# EAGLE design airball_sensor_board_v3 (EAGLE 8.5.2)
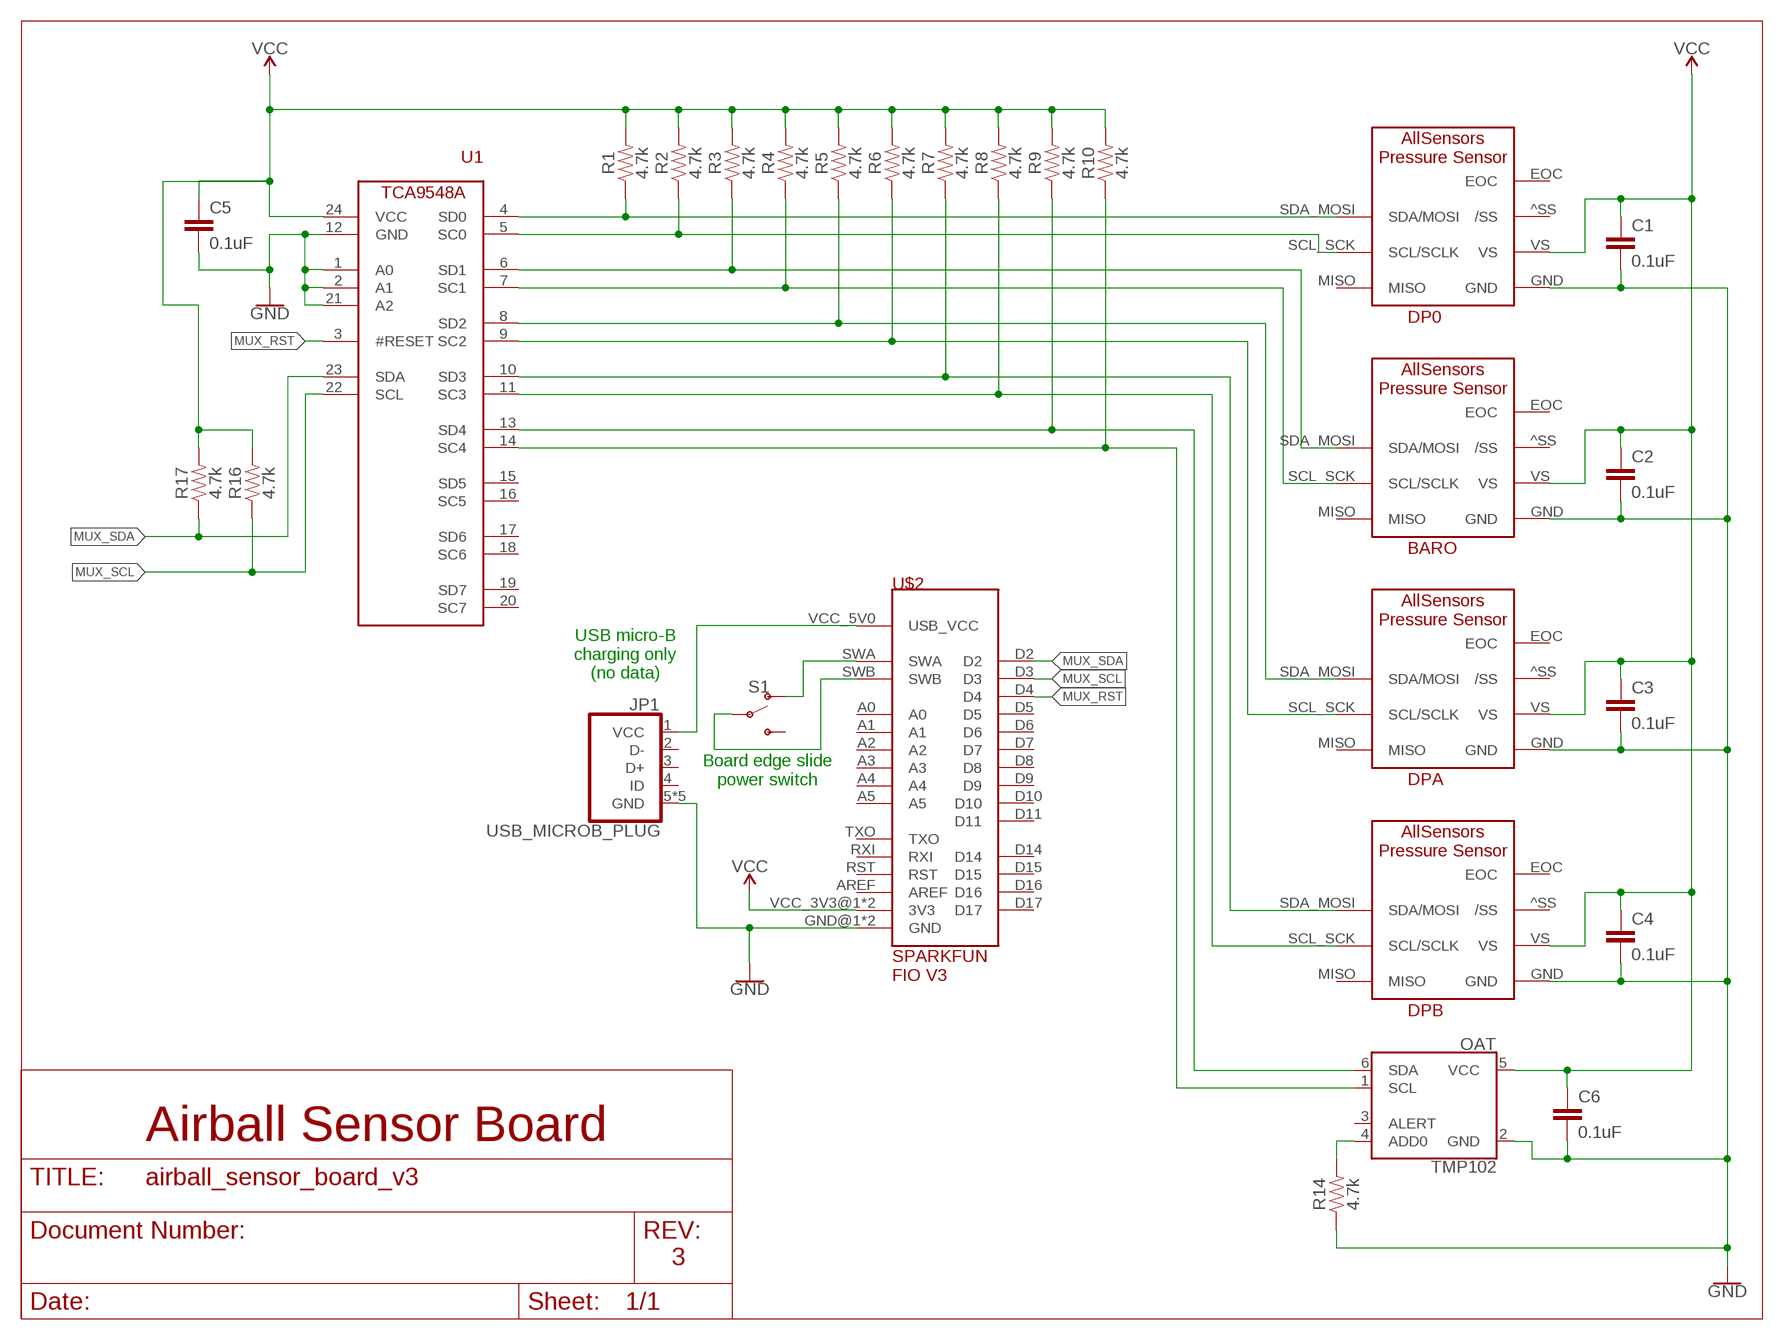
[diagram p0: schematic, sheet 1]

## Parts
BARO  ALL_SENSORS_DLHR_E1ND  [ALL_SENSORS_E1BD_8PIN_THRU]
C1  0.1uF  0.1UF-0603-25V-5%  [0603]
C2  0.1uF  0.1UF-0603-25V-5%  [0603]
C3  0.1uF  0.1UF-0603-25V-5%  [0603]
C4  0.1uF  0.1UF-0603-25V-5%  [0603]
C5  0.1uF  0.1UF-0603-25V-5%  [0603]
C6  0.1uF  0.1UF-0603-25V-5%  [0603]
DP0  ALL_SENSORS_DLHR_E1ND  [ALL_SENSORS_E1BD_8PIN_THRU]
DPA  ALL_SENSORS_DLHR_E1ND  [ALL_SENSORS_E1BD_8PIN_THRU]
DPB  ALL_SENSORS_DLHR_E1ND  [ALL_SENSORS_E1BD_8PIN_THRU]
JP1  USB_MICROB_PLUG  [USB_MICRO_B_TYCO]
OAT  TMP102  [SOT563]
R1  4.7k  4.7KOHM-0603-1/10W-1%  [0603]
R2  4.7k  4.7KOHM-0603-1/10W-1%  [0603]
R3  4.7k  4.7KOHM-0603-1/10W-1%  [0603]
R4  4.7k  4.7KOHM-0603-1/10W-1%  [0603]
R5  4.7k  4.7KOHM-0603-1/10W-1%  [0603]
R6  4.7k  4.7KOHM-0603-1/10W-1%  [0603]
R7  4.7k  4.7KOHM-0603-1/10W-1%  [0603]
R8  4.7k  4.7KOHM-0603-1/10W-1%  [0603]
R9  4.7k  4.7KOHM-0603-1/10W-1%  [0603]
R10  4.7k  4.7KOHM-0603-1/10W-1%  [0603]
R14  4.7k  4.7KOHM-0603-1/10W-1%  [0603]
R16  4.7k  4.7KOHM-0603-1/10W-1%  [0603]
R17  4.7k  4.7KOHM-0603-1/10W-1%  [0603]
S1  SWITCH-SPDT-SMD-RIGHT-ANGLE  [SWITCH_SPST_SMD_A]
U1  TCA9548ATSSOP24  [TSSOP24]
U$2  SPARKFUN_FIO_V3  [SPARKFUN_FIO_V3]

## Nets
GND [power]: BARO.GND C1.2 C2.2 C3.2 C4.2 C5.2 C6.2 DP0.GND DPA.GND DPB.GND JP1.5(GND) JP1.SH@1(GND) JP1.SH@2(GND) JP1.SH@3(GND) JP1.SH@4(GND) OAT.2(GND) R14.1 U1.1(A0) U1.2(A1) U1.12(GND) U1.21(A2) U$2.GND@1(GND) U$2.GND@2(GND)
MUX_RST: U1.3(#RESET) U$2.D4
MUX_SCL: R16.1 U1.22(SCL) U$2.D3
MUX_SDA: R17.1 U1.23(SDA) U$2.D2
OAT_ADD0: OAT.4(ADD0) R14.2
SCL_BARO: BARO.SCL_SCK(SCL/SCLK) R4.1 U1.7(SC1)
SCL_DP0: DP0.SCL_SCK(SCL/SCLK) R2.1 U1.5(SC0)
SCL_DPA: DPA.SCL_SCK(SCL/SCLK) R6.1 U1.9(SC2)
SCL_DPB: DPB.SCL_SCK(SCL/SCLK) R8.1 U1.11(SC3)
SCL_OAT: OAT.1(SCL) R10.1 U1.14(SC4)
SDA_BARO: BARO.SDA_MOSI(SDA/MOSI) R3.1 U1.6(SD1)
SDA_DP0: DP0.SDA_MOSI(SDA/MOSI) R1.1 U1.4(SD0)
SDA_DPA: DPA.SDA_MOSI(SDA/MOSI) R5.1 U1.8(SD2)
SDA_DPB: DPB.SDA_MOSI(SDA/MOSI) R7.1 U1.10(SD3)
SDA_OAT: OAT.6(SDA) R9.1 U1.13(SD4)
SWA [power]: S1.1(O) U$2.SWA
SWB [power]: S1.2(P) U$2.SWB
VCC_3V3 [power]: BARO.VS C1.1 C2.1 C3.1 C4.1 C5.1 C6.1 DP0.VS DPA.VS DPB.VS OAT.5(VCC) R1.2 R2.2 R3.2 R4.2 R5.2 R6.2 R7.2 R8.2 R9.2 R10.2 R16.2 R17.2 U1.24(VCC) U$2.VCC_3V3@1(3V3) U$2.VCC_3V3@2(3V3) ; supply symbol labelled VCC
VCC_USB [power]: JP1.1(VCC) U$2.VCC_5V0(USB_VCC)
Unconnected: BARO.^SS(/SS) BARO.EOC BARO.MISO DP0.^SS(/SS) DP0.EOC DP0.MISO DPA.^SS(/SS) DPA.EOC DPA.MISO DPB.^SS(/SS) DPB.EOC DPB.MISO JP1.2(D-) JP1.3(D+) JP1.4(ID) OAT.3(ALERT) S1.3(S) U1.15(SD5) U1.16(SC5) U1.17(SD6) U1.18(SC6) U1.19(SD7) U1.20(SC7) U$2.A0 U$2.A1 U$2.A2 U$2.A3 U$2.A4 U$2.A5 U$2.AREF U$2.D5 U$2.D6 U$2.D7 U$2.D8 U$2.D9 U$2.D10 U$2.D11 U$2.D14 U$2.D15 U$2.D16 U$2.D17 U$2.RST U$2.RXI U$2.TXO

## Notes on the sheet
- USB micro-B
  charging only
  (no data)
- Board edge slide
  power switch
- Airball Sensor Board
- 3

## Library data of the parts
BARO DP0 DPA DPB = microbuilder:ALL_SENSORS_DLHR_E1ND: All Sensors DLHR sensor, E1ND package 8 pin DIP 100 mil pin spacing 600 mil between pin rows 2 barbed pressure ports, same side
C1-C6 = SparkFun-Capacitors:0.1UF: 0.1µF ceramic capacitors A capacitor is a passive two-terminal electrical component used to store electrical energy temporarily in an electric field.; PROD_ID: CAP-08604
JP1 = jcole:USB_MICROB_PLUG: USB Micro-B Plug Comes in a variety of packages. Check out Hirose's ZX-x0 line: http://www.hirose.co.jp/cataloge_hp/e24200011.pdf
OAT = SparkFun-Sensors:TMP102: Texas Instruments TMP102 Low-Power Digital Temperature Sensor The TMP102 is a digital sensor (I2C a.k.a. TWI), has a resolution of 0.0625°C, and is accurate up to 0.5°C. This is a very handy sensor that requires a very low-current. Datasheet <http://www.sparkfun.com/datasheets/Sensors/Temperature/tmp102.pdf> SparkFun Products SparkFun Digital Temperature Sensor Breakout - TMP102 <https://www.sparkfun.com/products/11931> (SEN-11931); PROD_ID: IC-09303
R1-R10 R14 R16 R17 = SparkFun-Resistors:4.7KOHM: 4.7kΩ resistor A resistor is a passive two-terminal electrical component that implements electrical resistance as a circuit element. Resistors act to reduce current flow, and, at the same time, act to lower voltage levels within circuits. - Wikipedia; PROD_ID: RES-07857
S1 = SparkFun-Switches:SWITCH-SPDT: Single Pole, Double Throw (SPDT) Switch Single-pole, double-throw (SPDT) switch. Variant Overview SMD-AYZ0202 Surface Mount DPDT Switch <https://www.sparkfun.com/products/597> (COM-00597) Used on e.g. LilyPad Arduino USB - ATmega32U4 Board <https://www.sparkfun.com/products/12049> PTH-11.6X4.0MM SPDT Mini Power Switch <https://www.sparkfun.com/products/102> (COM-00102) Used on e.g. SparkFun Simon Says - Through-Hole Soldering Kit <https://www.sparkfun.com/products/10547> (KIT-10547) PTH-11.6X4.0MM-KIT KIT version of SPDT Mini Power Switch - Simplifies soldering by removing tStop of switch pins - only one side can be soldered. PTH-11.6X4.0MM-LOCK LOCK version of SPDT Mini Power Switch - Offset pins hold switch in place for easier soldering. SMD-RIGHT-ANGLE Surface Mount Right Angle Switch <https://www.sparkfun.com/products/10860> (COM-10860) Used on e.g. SparkFun ESP8266 Thing <https://www.sparkfun.com/products/13231>; PROD_ID: SWCH-10651; SF_SKU: COM-10860
U1 = microbuilder:TCA9548A: Texas Instruments TCA9548A 1-to-8 I2C multiplexer. Supported packages: TSSOP24
U$2 = microbuilder:SPARKFUN_FIO_V3

## Net classes
0 signal: width 0.152 mm
1 power: width 0.305 mm

## Board
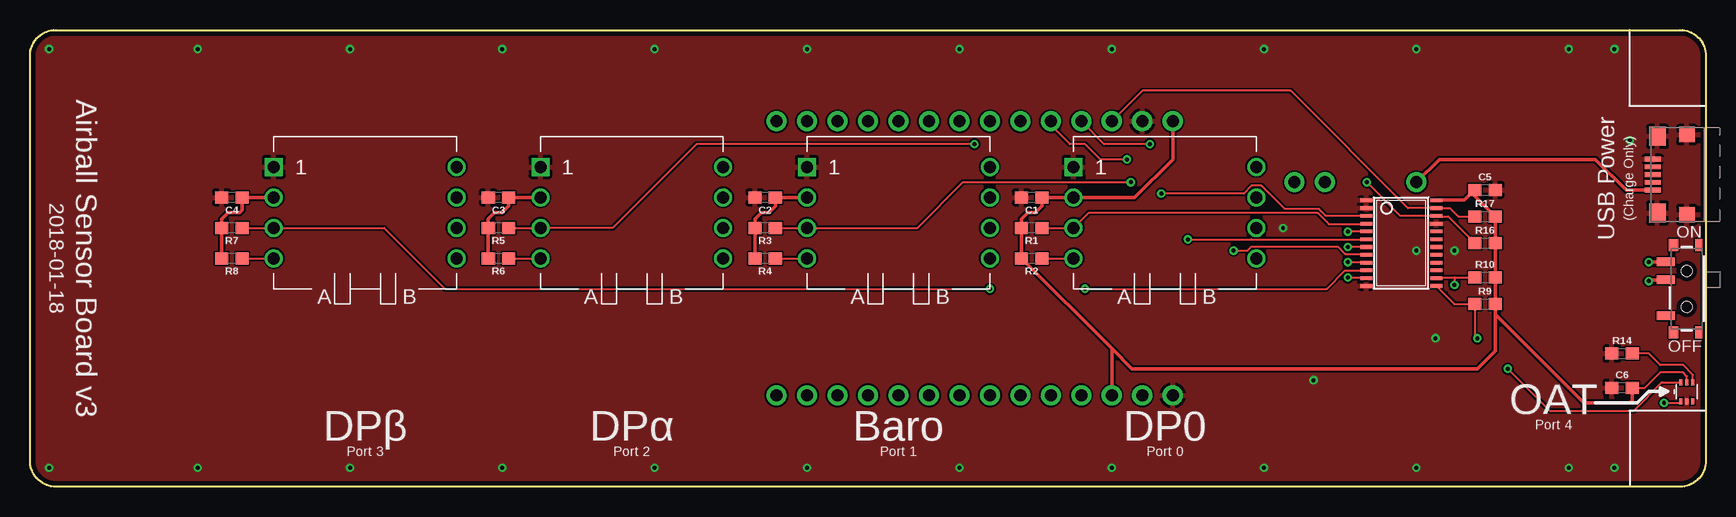
[diagram p1: board, top side]
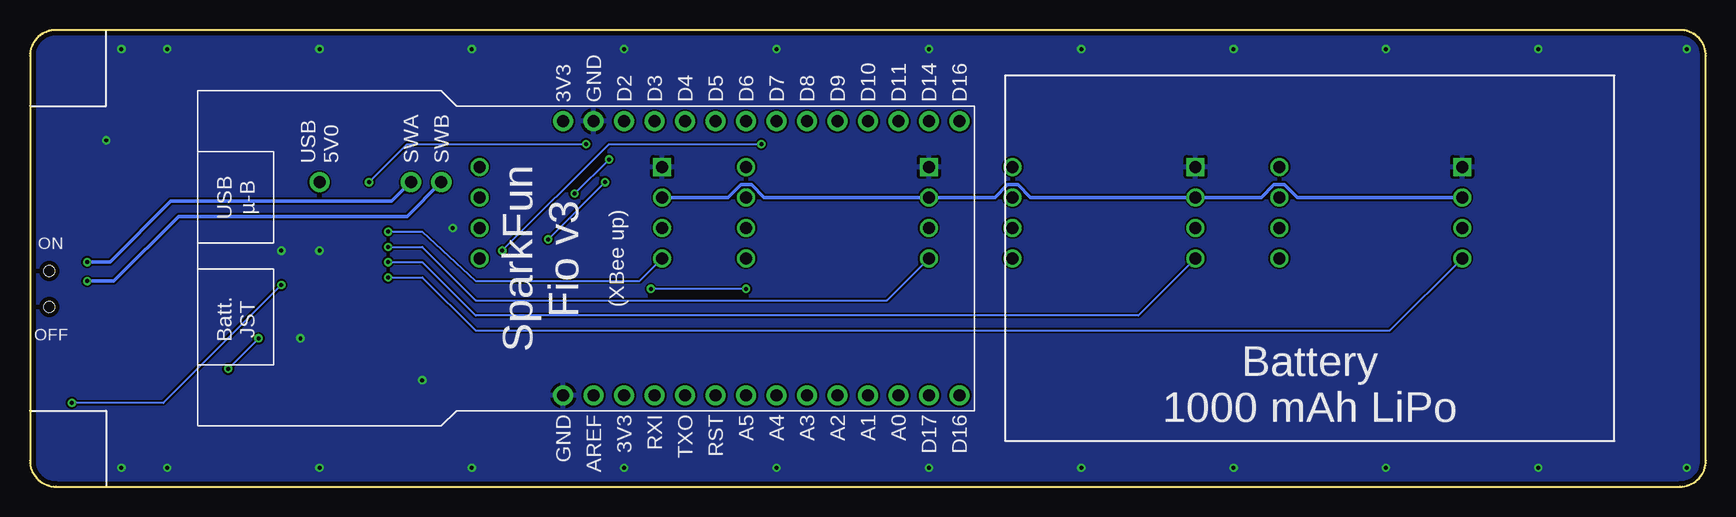
[diagram p2: board, bottom side, seen from below]

Size 139.7 x 38.1 mm. Coordinates in mm from the lower left corner, seen from the top.
Outline: 2.17,38.1 137.53,38.1 arc-90 139.7,35.93 139.7,2.17 arc-90 137.53,0 2.17,0 arc-90 0,2.17 0,35.93 arc-90 2.17,38.1
Copper layers (1*16): Top 0.0356mm / dielectric 1.5011mm / Bottom 0.0356mm
Design rules "oshpark-2layer *": minimum track width 6mil, minimum drill 13mil, track to track 6mil, track to pad 6mil, pad to pad 6mil, via to via 6mil, smd to smd 6mil, copper to edge 15mil, drill to drill 6mil, minimum pad ring 7mil, minimum via ring 7mil, stop-mask expansion 2.5mil, vias tented up to drill 15mil, thermal gap 10mil

### Footprints (pad centres in the part's own frame; a part is rotated, then mirrored left to right if it is on the bottom)
ALL_SENSORS_E1BD_8PIN_THRU = drill 1: ^SS 7.62,3.81; EOC 7.62,-3.81; MISO 7.62,-1.27; NC 7.62,1.27; SCL_SCK -7.62,-3.81; SDA_MOSI -7.62,-1.27; VS -7.62,1.27 | drill 1 square: GND -7.62,3.81
0603 = smd 1.1 x 1: 1 -0.85,0; 2 0.85,0
USB_MICRO_B_TYCO = smd 0.4 x 1.35: 1 -1.3,2.85; 2 -0.65,2.85; 3 0,2.85; 4 0.65,2.85; 5 1.3,2.85 | smd 1.3 x 1.3: SH@1 3.35,0; SH@2 -3.35,0 | smd 1.6 x 1.4: SH@3 3.2,2.45; SH@4 -3.2,2.45
SOT563 = smd 0.508 x 0.249: 1 -0.8,0.498; 2 -0.8,0.003; 3 -0.8,-0.506; 4 0.776,-0.506; 5 0.776,0.003; 6 0.776,0.498
SWITCH_SPST_SMD_A = smd 0.7 x 1.5: 1 -2.25,-1.75; 2 -0.75,-1.75; 3 2.25,-1.75 | smd 1 x 0.6: GND1 -3.65,1; GND3 3.65,1 | smd 1 x 0.8: GND2 -3.65,-1.1; GND4 3.65,-1.1 | hole 0.9: -1.5,0; 1.5,0
TSSOP24 = smd 0.305 x 0.991: 1 -3.575,-2.918; 2 -2.925,-2.918; 3 -2.275,-2.918; 4 -1.625,-2.918; 5 -0.975,-2.918; 6 -0.325,-2.918; 7 0.325,-2.918; 8 0.975,-2.918; 9 1.625,-2.918; 10 2.275,-2.918; 11 2.925,-2.918; 12 3.575,-2.918; 13 3.575,2.918; 14 2.925,2.918; 15 2.275,2.918; 16 1.625,2.918; 17 0.975,2.918; 18 0.325,2.918; 19 -0.325,2.918; 20 -0.975,2.918; 21 -1.625,2.918; 22 -2.275,2.918; 23 -2.925,2.918; 24 -3.575,2.918
SPARKFUN_FIO_V3 = drill 1 pad 1.676: A0 -11.43,-11.43; A1 -11.43,-8.89; A2 -11.43,-6.35; A3 -11.43,-3.81; A4 -11.43,-1.27; A5 -11.43,1.27; AREF -11.43,13.97; D2 11.43,11.43; D3 11.43,8.89; D4 11.43,6.35; D5 11.43,3.81; D6 11.43,1.27; D7 11.43,-1.27; D8 11.43,-3.81; D9 11.43,-6.35; D10 11.43,-8.89; D11 11.43,-11.43; D14 11.43,-13.97; D15 11.43,-16.51; D16 -11.43,-16.51; D17 -11.43,-13.97; GND@1 11.43,13.97; GND@2 -11.43,16.51; RST -11.43,3.81; RXI -11.43,8.89; SWA 6.35,29.21; SWB 6.35,26.67; TXO -11.43,6.35; VCC_3V3@1 11.43,16.51; VCC_3V3@2 -11.43,11.43; VCC_5V0 6.35,36.83

### Placement (x,y rotation side)
BARO  72.39,22.86 0 top
C1  83.5,24.13 180 top
C2  61.28,24.13 180 top
C3  39.05,24.13 180 top
C4  16.83,24.13 180 top
C5  121.28,24.77 0 top
C6  132.72,8.26 180 top
DP0  94.61,22.86 0 top
DPA  50.16,22.86 0 top
DPB  27.94,22.86 0 top
JP1  138.11,26.04 90 top
OAT  138.11,7.94 90 top
R1  83.5,21.59 180 top
R2  83.5,19.05 180 top
R3  61.28,21.59 180 top
R4  61.28,19.05 180 top
R5  39.05,21.59 180 top
R6  39.05,19.05 180 top
R7  16.83,21.59 180 top
R8  16.83,19.05 180 top
R9  121.28,15.24 0 top
R10  121.28,17.46 0 top
R14  132.72,11.11 0 top
R16  121.28,20.32 0 top
R17  121.28,22.54 0 top
S1  138.11,16.51 270 top
U1  114.3,20.32 270 top
U$2  78.74,19.05 90 bottom

### Tracks (layer width: path | path; a pad name or v marks a point on that pad's centre or on a via)
GND  (via drill 0.33)
  other vias: 1.59,36.51 1.59,1.59 132.08,36.51 132.08,1.59 133.35,28.89 13.97,36.51 26.67,36.51 39.37,36.51 52.07,36.51 64.77,36.51 77.47,36.51 90.17,36.51 102.87,36.51 115.57,36.51 128.27,36.51 118.75,19.68 115.57,19.68 117.16,12.38 107,8.89 104.46,21.59 13.97,1.59 26.67,1.59 39.37,1.59 52.07,1.59 64.77,1.59 77.47,1.59 90.17,1.59 102.87,1.59 115.57,1.59 128.27,1.59
  pour Top (isolate 0.152): 0,38.1 139.7,38.1 139.7,0 0,0
  pour Bottom: 0,38.1 139.7,38.1 139.7,0 0,0
MUX_RST  (via drill 0.33)
  Top 0.152: U1.3 108.01,22.59 107.44,23.16 104.58,23.16 102.64,25.11 101.83,25.11 101.17,24.45 v94.3,24.45 | v91.44,27.3 89.22,27.3 87.95,28.57 86.68,28.57 85.09,30.16 U$2.D4
  Bottom 0.152: v94.3,24.45 v91.44,27.3
MUX_SCL  (via drill 0.33)
  Top 0.152: R16.1 118.21,22.54 117.27,22.54 U1.22 114.25,22.59 v111.44,25.4 | v93.34,28.57 89.53,28.57 U$2.D3
  Bottom 0.152: v111.44,25.4 108.27,28.57 v93.34,28.57
MUX_SDA
  Top 0.152: R17.1 119.06,22.54 118.36,23.25 U1.23 114.87,23.25 105.09,33.02 92.71,33.02 U$2.D2
OAT_ADD0
  Top 0.152: OAT.4 138.62,9.34 137.79,10.16 135.89,10.16 134.94,11.11 R14.2
SCL_BARO  (via drill 0.33)
  Top 0.152: R4.1 BARO.SCL_SCK | U1.7 v109.86,20
  Bottom 0.152: v109.86,20 107,20 102.55,15.56 68.26,15.56 BARO.SCL_SCK
SCL_DP0  (via drill 0.33)
  Top 0.152: U1.5 109.88,21.3 v109.86,21.27 | R2.1 DP0.SCL_SCK
  Bottom 0.152: v109.86,21.27 107,21.27 102.55,17.14 88.9,17.14 DP0.SCL_SCK
SCL_DPA  (via drill 0.33)
  Top 0.152: R6.1 DPA.SCL_SCK | U1.9 109.89,18.7 v109.86,18.73
  Bottom 0.152: v109.86,18.73 107,18.73 102.55,14.29 47.31,14.29 DPA.SCL_SCK
SCL_DPB  (via drill 0.33)
  Top 0.152: R8.1 DPB.SCL_SCK | U1.11 109.92,17.39 v109.86,17.46
  Bottom 0.152: v109.86,17.46 107,17.46 102.55,13.02 26.35,13.02 DPB.SCL_SCK
SCL_OAT  (via drill 0.33)
  Top 0.152: U1.14 117.28,17.46 118.75,17.46 | 118.75,17.46 v118.75,16.83 | v136.21,6.99 137.46,6.99 OAT.1 | 118.75,17.46 R10.1
  Bottom 0.152: v118.75,16.83 128.59,6.99 v136.21,6.99
SDA_BARO  (via drill 0.33)
  Top 0.152: R3.1 BARO.SDA_MOSI 73.98,21.59 77.79,25.4 v91.76,25.4 | v96.52,20.64 101.8,20.64 101.83,20.61 111.35,20.61 U1.6
  Bottom 0.152: v91.76,25.4 v96.52,20.64
SDA_DP0
  Top 0.152: R1.1 DP0.SDA_MOSI 88.27,22.86 107.31,22.86 108.27,21.91 111.34,21.91 U1.4
SDA_DPA  (via drill 0.33)
  Top 0.152: R5.1 DPA.SDA_MOSI 48.58,21.59 55.56,28.57 v78.74,28.57 | v100.33,19.68 101.49,19.68 101.83,20.03 109.02,20.03 109.62,19.43 111.3,19.43 U1.8
  Bottom 0.152: 100.33,20 v100.33,19.68 91.44,28.57 v78.74,28.57
SDA_DPB  (via drill 0.33)
  Top 0.152: R7.1 DPB.SDA_MOSI 29.53,21.59 34.61,16.51 v80.01,16.51 | U1.10 111.37,18.03 109.62,18.03 108.09,16.51 v87.95,16.51
  Bottom 0.152: v80.01,16.51 v87.95,16.51
SDA_OAT  (via drill 0.33)
  Top 0.152: U1.13 118.72,15.24 R9.1 120.44,12.6 v120.65,12.38 | OAT.6 136.03,8.71 133.67,6.35 129.54,6.35 129.32,6.35 126.68,6.35 v123.19,9.84
  Bottom 0.152: v120.65,12.38 v123.19,9.84
SWA  (via drill 0.33)
  Top 0.305: v134.94,18.73 134.97,18.76 S1.1
  Bottom 0.305: v134.94,18.73 133.03,18.73 127.95,23.81 109.54,23.81 U$2.SWA
SWB  (via drill 0.33)
  Top 0.305: S1.2 135.05,17.26 v134.94,17.14
  Bottom 0.305: v134.94,17.14 132.72,17.14 127.32,22.54 108.27,22.54 U$2.SWB
VCC_3V3
  Top 0.152: C6.1 134.62,8.26 135.89,9.53 137.79,9.53 138.11,9.21 138.11,9.2 OAT.5
  Top 0.305: R9.2 R10.2 R16.2 R17.2 120.44,24.24 C5.1 119.56,23.89 U1.24 | C6.1 133.56,7.2 133.35,6.99 129.54,6.99 122.14,14.39 R9.2 | R8.2 R7.2 15.98,22.33 16.51,22.86 17.46,22.86 17.68,23.07 C4.1 DPB.VS | R6.2 R5.2 38.2,22.33 38.73,22.86 39.37,22.86 39.9,23.39 C3.1 DPA.VS | R4.2 R3.2 60.43,22.33 60.96,22.86 61.59,22.86 62.13,23.39 C2.1 BARO.VS | 90.17,11.53 R2.2 R1.2 82.65,22.33 83.19,22.86 83.82,22.86 84.35,23.39 C1.1 DP0.VS 92.08,24.13 95.25,27.3 U$2.VCC_3V3@1 | R9.2 122.14,11.33 120.65,9.84 91.86,9.84 90.17,11.53 | U$2.VCC_3V3@2 90.17,11.53
  Bottom 0.305: DP0.VS 81.5,24.13 80.45,25.18 79.57,25.18 78.52,24.13 BARO.VS 59.28,24.13 58.22,25.18 57.35,25.18 56.29,24.13 DPA.VS 37.05,24.13 36,25.18 35.12,25.18 34.07,24.13 DPB.VS
VCC_USB
  Top 0.305: U$2.VCC_5V0 117.47,27.3 130.49,27.3 133.06,24.73 JP1.1

### Text on the board
tPlace: OAT | DPβ | DPα | Baro | DP0
bPlace: Battery / 1000 mAh LiPo
tNames: USB Power | (Charge Only) | ON | 2018-01-18 | Airball Sensor Board v3 | OFF | Port 4 | Port 3 | Port 2 | Port 1 | Port 0
bNames: D16 | D14 | D11 | D10 | D9 | D8 | D7 | D6 | D5 | D4 | D3 | D2 | GND | 3V3 | SWB | SWA | USB / 5V0 | ON | OFF | D16 | D17 | A0 | A1 | A2 | A3 | A4 | A5 | RST | TXO | RXI | 3V3 | AREF | GND